# EAGLE board Send3 (EAGLE 6.5.0)
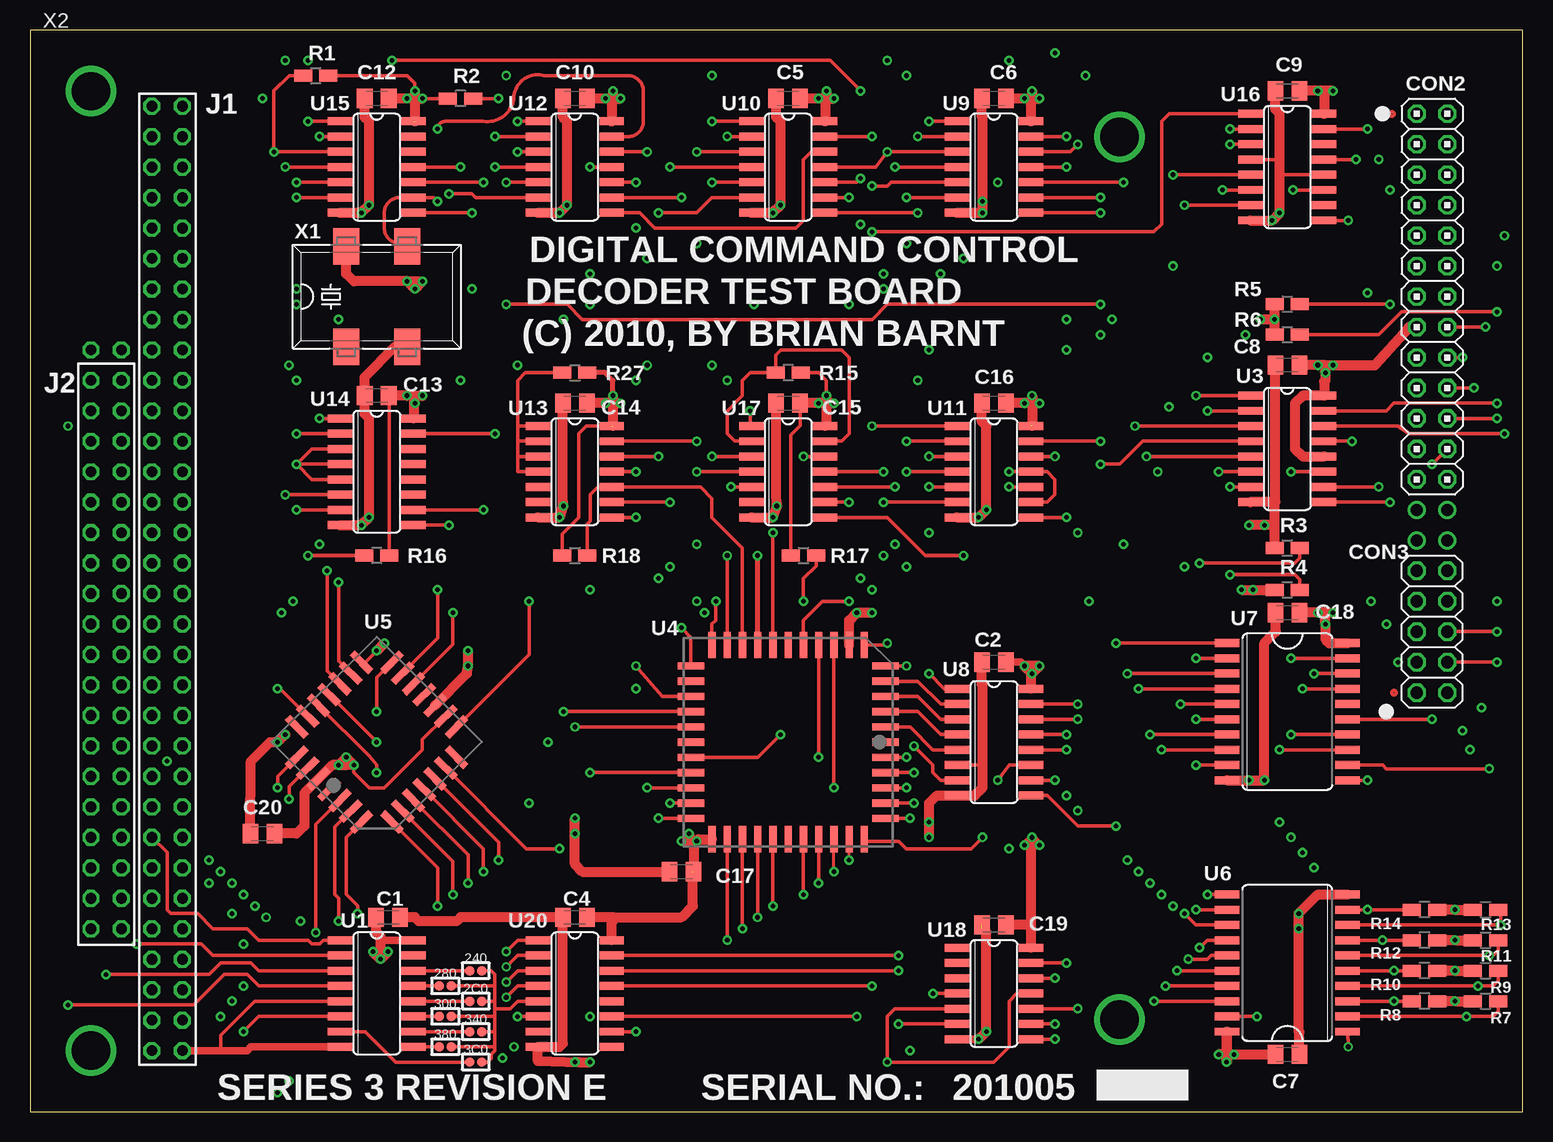
[diagram p7: board, top side]
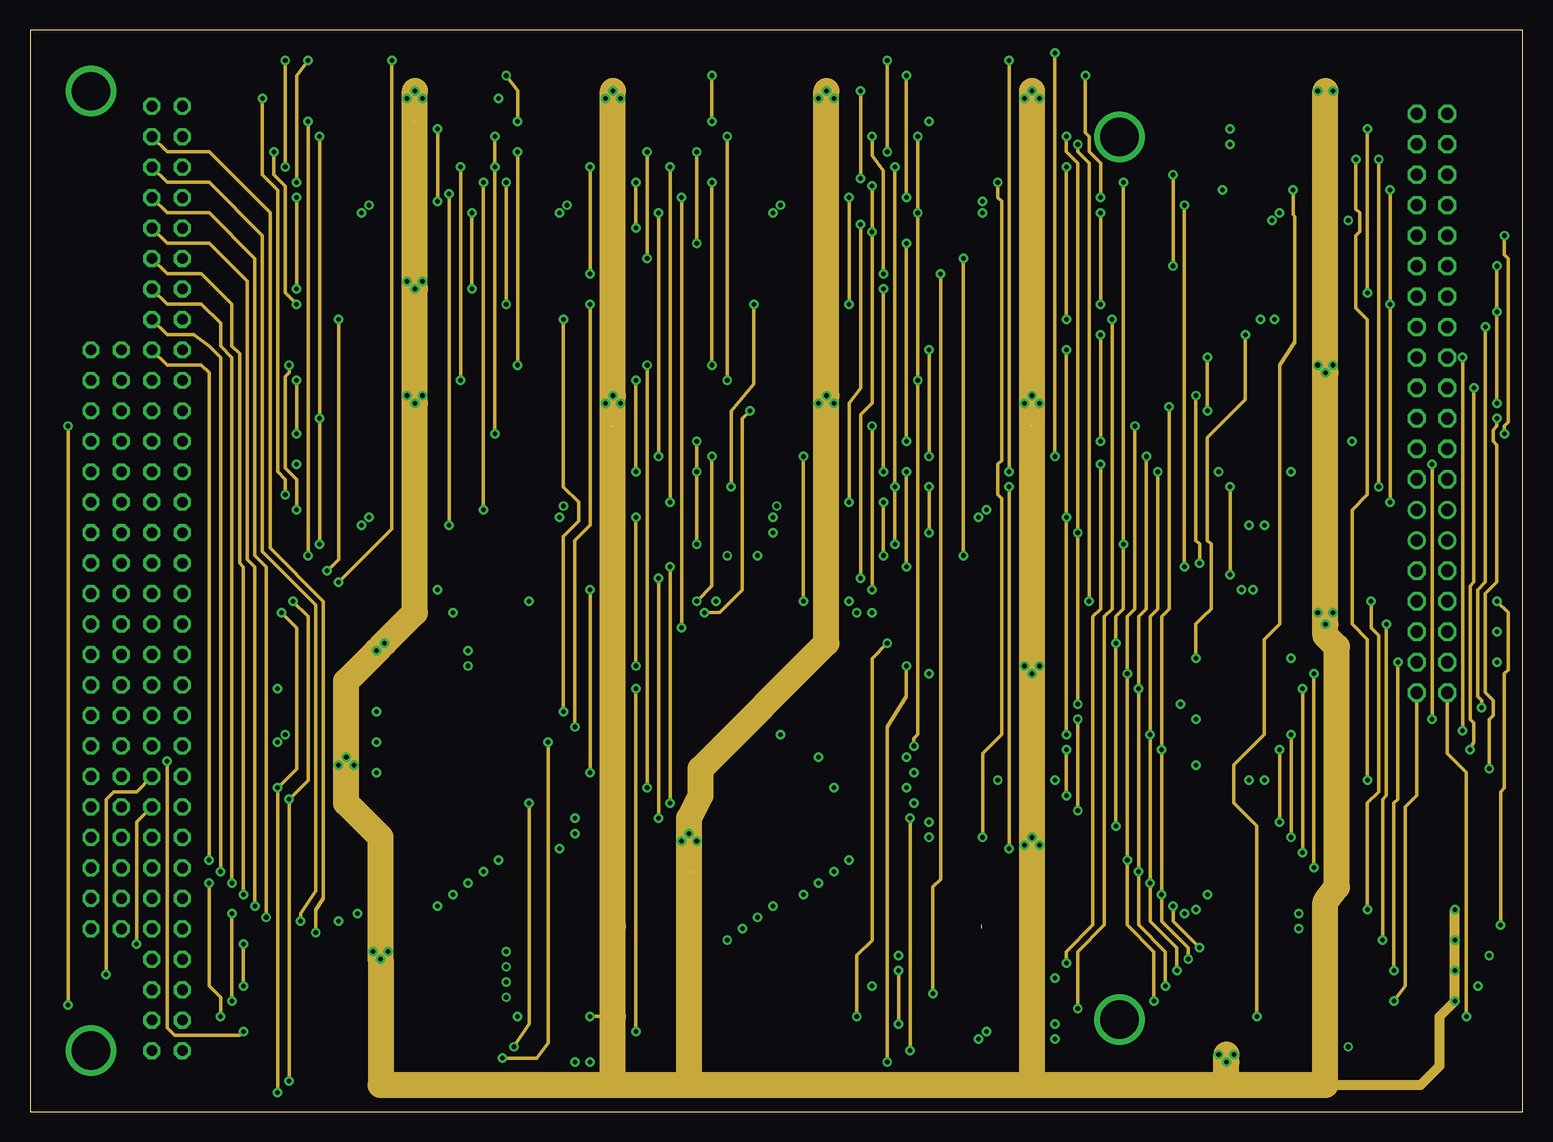
[diagram p8: board, inner layer Route2]
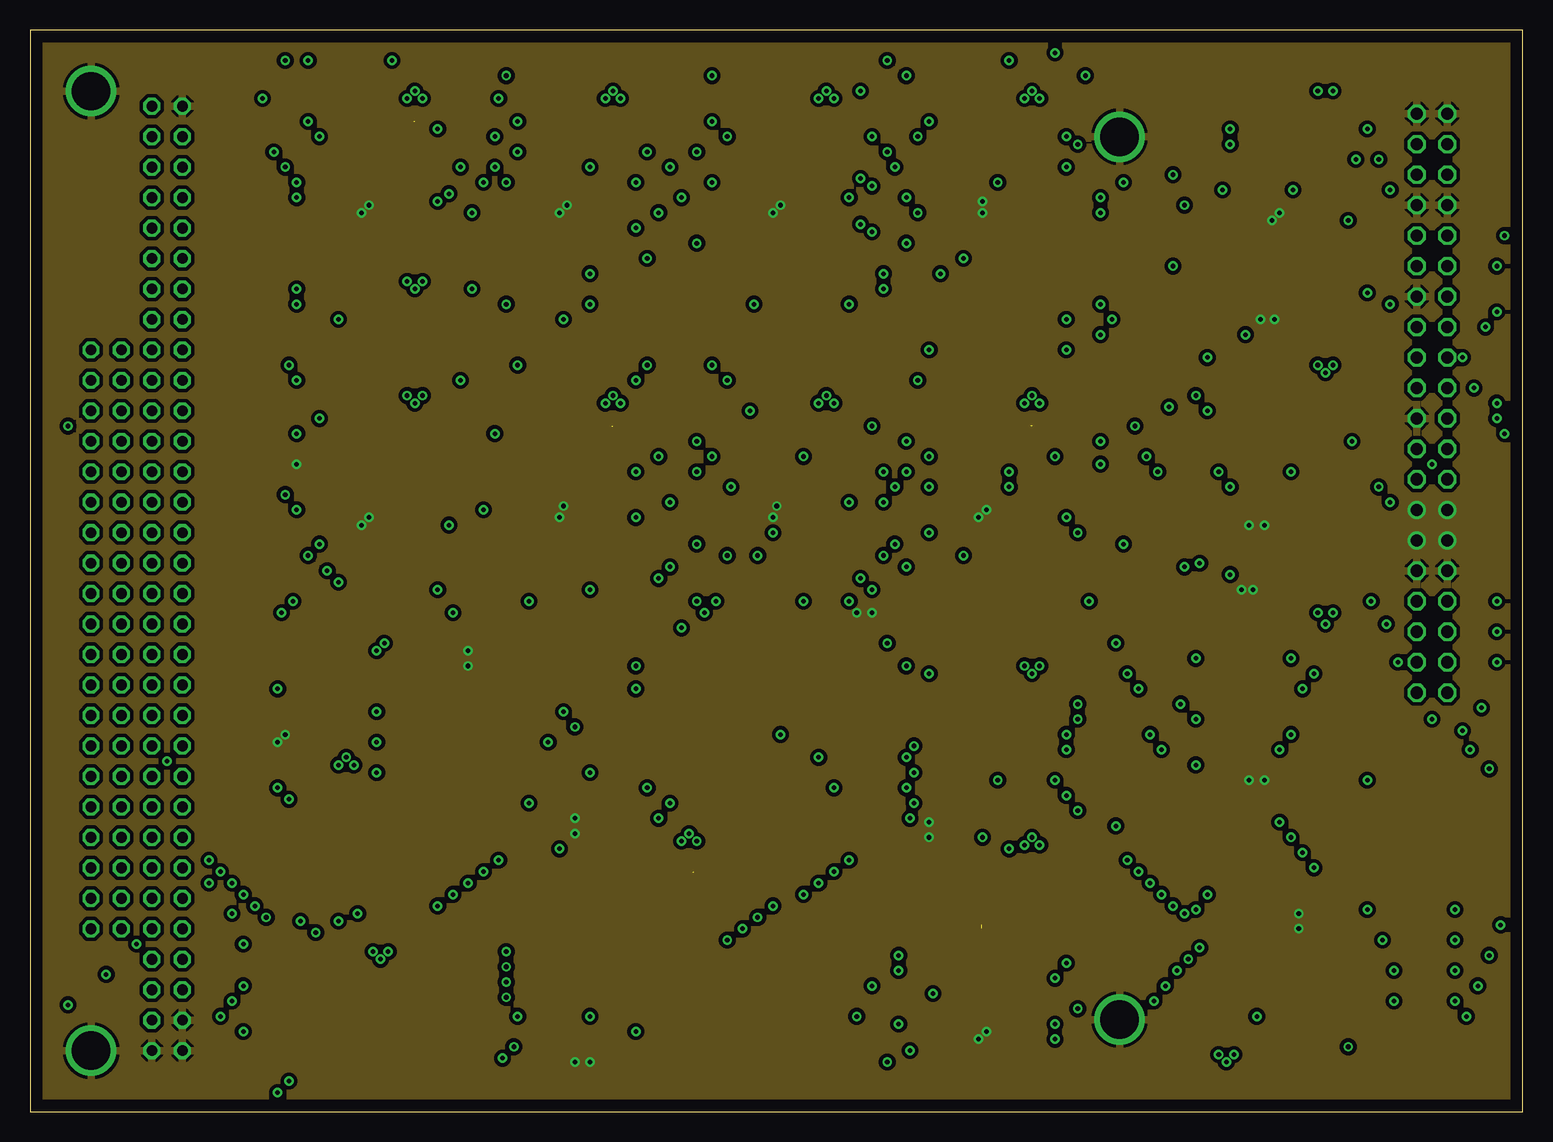
[diagram p9: board, inner layer Route15]
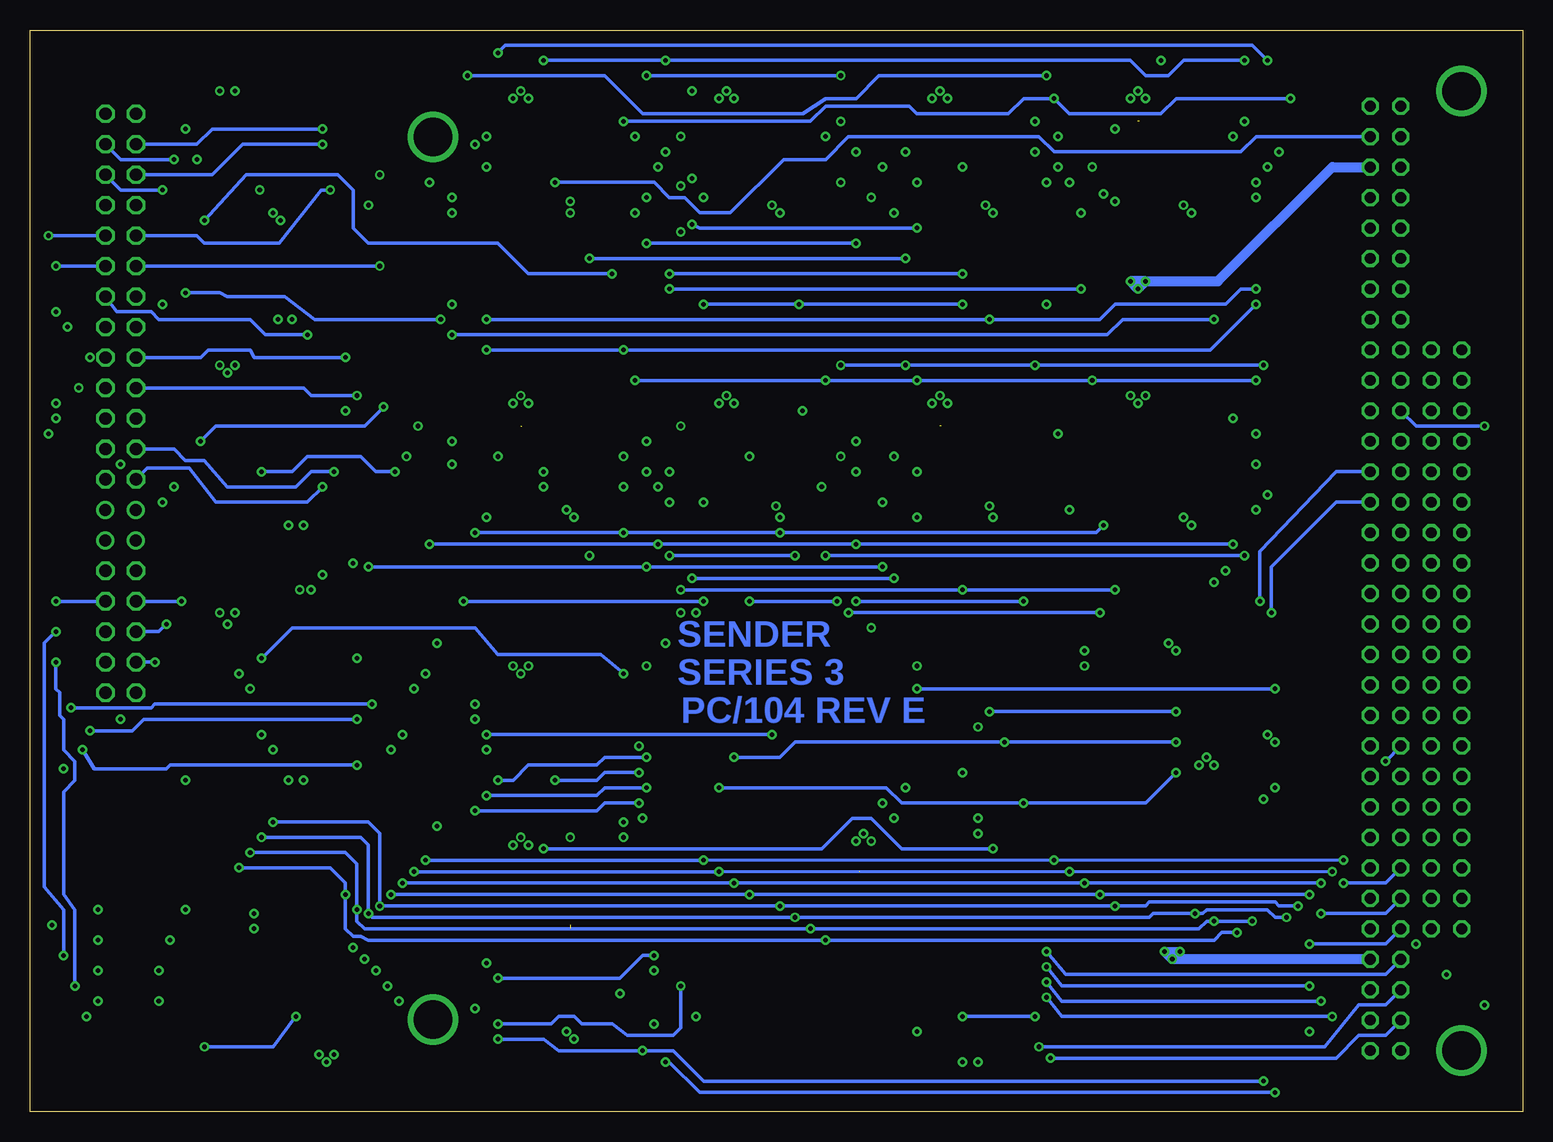
[diagram p10: board, bottom side, seen from below]

Size 124.4 x 90.2 mm. Coordinates in mm from the lower left corner, seen from the top.
Copper layers (1+2*15+16): Top 0.035mm / dielectric 0.2mm / Route2 0.035mm / dielectric 0.15mm / Route15 0.035mm / dielectric 0.2mm / Bottom 0.035mm
Design rules "Advanced33 *": minimum track width 8mil, minimum drill 15mil, track to track 8mil, track to pad 8mil, pad to pad 8mil, via to via 8mil, smd to smd 8mil, copper to edge 40mil, drill to drill 8mil, minimum pad ring 10mil, minimum via ring 8mil, stop-mask expansion 4mil, vias tented up to drill 25mil, thermal gap 10mil

## Footprints (pad centres in the part's own frame; a part is rotated, then mirrored left to right if it is on the bottom)
C0805K = smd 1.3 x 1.6: 1 -1,0; 2 1,0
2X13 = drill 1.016 octagon: 1 -15.24,-1.27; 2 -15.24,1.27; 3 -12.7,-1.27; 4 -12.7,1.27; 5 -10.16,-1.27; 6 -10.16,1.27; 7 -7.62,-1.27; 8 -7.62,1.27; 9 -5.08,-1.27; 10 -5.08,1.27; 11 -2.54,-1.27; 12 -2.54,1.27; 13 0,-1.27; 14 0,1.27; 15 2.54,-1.27; 16 2.54,1.27; 17 5.08,-1.27; 18 5.08,1.27; 19 7.62,-1.27; 20 7.62,1.27; 21 10.16,-1.27; 22 10.16,1.27; 23 12.7,-1.27; 24 12.7,1.27; 25 15.24,-1.27; 26 15.24,1.27
2X05 = drill 1.016 octagon: 1 -5.08,-1.27; 2 -5.08,1.27; 3 -2.54,-1.27; 4 -2.54,1.27; 5 0,-1.27; 6 0,1.27; 7 2.54,-1.27; 8 2.54,1.27; 9 5.08,-1.27; 10 5.08,1.27
SOLDER_BRIDGE = smd 0.787 x 0.787: P$1 -0.508,0; P$2 0.508,0
R0805W = smd 1.5 x 1: 1 -1.052,0; 2 1.052,0
SO16 = smd 0.66 x 2.032: 1 -4.445,-3.073; 2 -3.175,-3.073; 3 -1.905,-3.073; 4 -0.635,-3.073; 5 0.635,-3.073; 6 1.905,-3.073; 7 3.175,-3.073; 8 4.445,-3.073; 9 4.445,3.073; 10 3.175,3.073; 11 1.905,3.073; 12 0.635,3.073; 13 -0.635,3.073; 14 -1.905,3.073; 15 -3.175,3.073; 16 -4.445,3.073
PLCC44 = smd 0.6 x 2.2: 1 0,8.1; 2 -1.27,8.1; 3 -2.54,8.1; 4 -3.81,8.1; 5 -5.08,8.1; 6 -6.35,8.1; 18 -6.35,-8.1; 19 -5.08,-8.1; 20 -3.81,-8.1; 21 -2.54,-8.1; 22 -1.27,-8.1; 23 0,-8.1; 24 1.27,-8.1; 25 2.54,-8.1; 26 3.81,-8.1; 27 5.08,-8.1; 28 6.35,-8.1; 40 6.35,8.1; 41 5.08,8.1; 42 3.81,8.1; 43 2.54,8.1; 44 1.27,8.1 | smd 2.2 x 0.6: 7 -8.1,6.35; 8 -8.1,5.08; 9 -8.1,3.81; 10 -8.1,2.54; 11 -8.1,1.27; 12 -8.1,0; 13 -8.1,-1.27; 14 -8.1,-2.54; 15 -8.1,-3.81; 16 -8.1,-5.08; 17 -8.1,-6.35; 29 8.1,-6.35; 30 8.1,-5.08; 31 8.1,-3.81; 32 8.1,-2.54; 33 8.1,-1.27; 34 8.1,0; 35 8.1,1.27; 36 8.1,2.54; 37 8.1,3.81; 38 8.1,5.08; 39 8.1,6.35
PLCC28S = smd 0.6 x 2.2: 1 0,5.6; 2 -1.27,5.6; 3 -2.54,5.6; 4 -3.81,5.6; 12 -3.81,-5.6; 13 -2.54,-5.6; 14 -1.27,-5.6; 15 0,-5.6; 16 1.27,-5.6; 17 2.54,-5.6; 18 3.81,-5.6; 26 3.81,5.6; 27 2.54,5.6; 28 1.27,5.6 | smd 2.2 x 0.6: 5 -5.6,3.81; 6 -5.6,2.54; 7 -5.6,1.27; 8 -5.6,0; 9 -5.6,-1.27; 10 -5.6,-2.54; 11 -5.6,-3.81; 19 5.6,-3.81; 20 5.6,-2.54; 21 5.6,-1.27; 22 5.6,0; 23 5.6,1.27; 24 5.6,2.54; 25 5.6,3.81
SO20W = smd 0.66 x 2.032: 1 -5.715,-5.029; 2 -4.445,-5.029; 3 -3.175,-5.029; 4 -1.905,-5.029; 5 -0.635,-5.029; 6 0.635,-5.029; 7 1.905,-5.029; 8 3.175,-5.029; 9 4.445,-5.029; 10 5.715,-5.029; 11 5.715,5.029; 12 4.445,5.029; 13 3.175,5.029; 14 1.905,5.029; 15 0.635,5.029; 16 -0.635,5.029; 17 -1.905,5.029; 18 -3.175,5.029; 19 -4.445,5.029; 20 -5.715,5.029
SO14 = smd 0.66 x 2.032: 1 -3.81,-3.073; 2 -2.54,-3.073; 3 -1.27,-3.073; 4 0,-3.073; 5 1.27,-3.073; 6 2.54,-3.073; 7 3.81,-3.073; 8 3.81,3.073; 9 2.54,3.073; 10 1.27,3.073; 11 0,3.073; 12 -1.27,3.073; 13 -2.54,3.073; 14 -3.81,3.073
1100S = smd 2.184 x 3.048: 1 -2.54,-4.191; 2 2.54,-4.191; 3 2.54,4.191; 4 -2.54,4.191
PC104-STANDARD = drill 0.9 pad 1.397 octagon: A1 10.16,83.82; A2 10.16,81.28; A3 10.16,78.74; A4 10.16,76.2; A5 10.16,73.66; A6 10.16,71.12; A7 10.16,68.58; A8 10.16,66.04; A9 10.16,63.5; A10 10.16,60.96; A11 10.16,58.42; A12 10.16,55.88; A13 10.16,53.34; A14 10.16,50.8; A15 10.16,48.26; A16 10.16,45.72; A17 10.16,43.18; A18 10.16,40.64; A19 10.16,38.1; A20 10.16,35.56; A21 10.16,33.02; A22 10.16,30.48; A23 10.16,27.94; A24 10.16,25.4; A25 10.16,22.86; A26 10.16,20.32; A27 10.16,17.78; A28 10.16,15.24; A29 10.16,12.7; A30 10.16,10.16; A31 10.16,7.62; A32 10.16,5.08; B1 12.7,83.82; B2 12.7,81.28; B3 12.7,78.74; B4 12.7,76.2; B5 12.7,73.66; B6 12.7,71.12; B7 12.7,68.58; B8 12.7,66.04; B9 12.7,63.5; B10 12.7,60.96; B11 12.7,58.42; B12 12.7,55.88; B13 12.7,53.34; B14 12.7,50.8; B15 12.7,48.26; B16 12.7,45.72; B17 12.7,43.18; B18 12.7,40.64; B19 12.7,38.1; B20 12.7,35.56; B21 12.7,33.02; B22 12.7,30.48; B23 12.7,27.94; B24 12.7,25.4; B25 12.7,22.86; B26 12.7,20.32; B27 12.7,17.78; B28 12.7,15.24; B29 12.7,12.7; B30 12.7,10.16; B31 12.7,7.62; B32 12.7,5.08; C0 7.62,63.5; C1 7.62,60.96; C2 7.62,58.42; C3 7.62,55.88; C4 7.62,53.34; C5 7.62,50.8; C6 7.62,48.26; C7 7.62,45.72; C8 7.62,43.18; C9 7.62,40.64; C10 7.62,38.1; C11 7.62,35.56; C12 7.62,33.02; C13 7.62,30.48; C14 7.62,27.94; C15 7.62,25.4; C16 7.62,22.86; C17 7.62,20.32; C18 7.62,17.78; C19 7.62,15.24; D0 5.08,63.5; D1 5.08,60.96; D2 5.08,58.42; D3 5.08,55.88; D4 5.08,53.34; D5 5.08,50.8; D6 5.08,48.26; D7 5.08,45.72; D8 5.08,43.18; D9 5.08,40.64; D10 5.08,38.1; D11 5.08,35.56; D12 5.08,33.02; D13 5.08,30.48; D14 5.08,27.94; D15 5.08,25.4; D16 5.08,22.86; D17 5.08,20.32; D18 5.08,17.78; D19 5.08,15.24 | drill 3.2 pad 4: GND@1 90.8,81.27; GND@2 90.8,7.67; GND@3 5.1,85.07; GND@4 5.1,5.07

## Placement (x,y rotation side)
C1  [C0805K]  29.84,16.22 0 top
C2  [C0805K]  80.33,37.5 180 top
C4  [C0805K]  45.4,16.22 180 top
C5  [C0805K]  63.18,84.48 180 top
C6  [C0805K]  80.33,84.48 180 top
C7  [C0805K]  104.78,4.79 0 top
C8  [C0805K]  104.78,62.26 180 top
C9  [C0805K]  104.78,85.12 180 top
C10  [C0805K]  45.4,84.48 180 top
C12  [C0805K]  28.89,84.48 180 top
C13  [C0805K]  28.89,59.72 180 top
C14  [C0805K]  45.4,59.09 180 top
C15  [C0805K]  63.18,59.09 180 top
C16  [C0805K]  80.33,59.09 180 top
C17  [C0805K]  54.29,20.03 180 top
C18  [C0805K]  104.78,41.62 180 top
C19  [C0805K]  80.33,15.59 180 top
C20  [C0805K]  19.37,23.21 180 top
CON2  [2X13]  116.84,67.97 270 top
CON3  [2X05]  116.84,40.04 90 top
JMPR2  [SOLDER_BRIDGE]  37.15,11.78 0 top
JMPR3  [SOLDER_BRIDGE]  34.61,10.51 0 top
JMPR4  [SOLDER_BRIDGE]  37.15,9.24 0 top
JMPR5  [SOLDER_BRIDGE]  34.61,7.97 0 top
JMPR6  [SOLDER_BRIDGE]  37.15,6.7 0 top
JMPR7  [SOLDER_BRIDGE]  34.61,5.43 0 top
JMPR8  [SOLDER_BRIDGE]  37.15,4.16 0 top
R1  10K  [R0805W]  23.81,86.39 0 top
R2  10K  [R0805W]  35.88,84.48 180 top
R3  10K  [R0805W]  104.78,47.02 0 top
R4  10K  [R0805W]  104.78,43.53 0 top
R5  10K  [R0805W]  104.78,67.34 0 top
R6  10K  [R0805W]  104.78,64.8 0 top
R7  10K  [R0805W]  121.28,9.24 0 top
R8  10K  [R0805W]  116.2,9.24 180 top
R9  10K  [R0805W]  121.28,11.78 0 top
R10  10K  [R0805W]  116.2,11.78 180 top
R11  10K  [R0805W]  121.28,14.32 0 top
R12  10K  [R0805W]  116.2,14.32 180 top
R13  10K  [R0805W]  121.28,16.86 0 top
R14  10K  [R0805W]  116.2,16.86 180 top
R15  10K  [R0805W]  63.18,61.62 180 top
R16  10K  [R0805W]  28.89,46.38 180 top
R17  10K  [R0805W]  64.45,46.38 0 top
R18  10K  [R0805W]  45.4,46.38 0 top
R27  10K  [R0805W]  45.4,61.62 0 top
U1  74AHC138D  [SO16]  28.89,9.87 270 top
U3  AM26C32CD  [SO16]  104.78,55.27 270 top
U4  [PLCC44]  63.18,30.83 270 top
U5  8254  [PLCC28S]  28.89,30.83 135 top
U6  74ACT540  [SO20W]  104.78,12.41 90 top
U7  74LS273DW  [SO20W]  104.78,33.37 270 top
U8  74HCT166D  [SO16]  80.33,30.83 270 top
U9  74ACT74D  [SO14]  80.33,78.77 270 top
U10  74ACT08D  [SO14]  63.18,78.77 270 top
U11  74ACT02D  [SO14]  80.33,53.37 270 top
U12  74ACT00D  [SO14]  45.4,78.77 270 top
U13  74ACT74D  [SO14]  45.4,53.37 270 top
U14  74ACT161D  [SO16]  28.89,53.37 270 top
U15  74AC04D  [SO14]  28.89,78.77 270 top
U16  AM26C31CD  [SO16]  104.78,78.77 270 top
U17  74ACT74D  [SO14]  63.18,53.37 270 top
U18  74ACT02D  [SO14]  80.33,9.87 270 top
U20  74AHC138D  [SO16]  45.4,9.87 270 top
U$5  [BORDER_AL]  -70.17,-74.58 0 top  (outside the outline)
X1  [1100S]  28.89,67.97 0 top
X2  PC104_CARD1  [PC104-STANDARD]  0,0.03 0 top

## Tracks (layer width: path | path; a pad name or v marks a point on that pad's centre or on a via)
82CLK0T  (via drill 0.38)
  Top 0.305: v81.6,52.1 U11.10 | v44.13,21.94 41.37,21.94 U5.10
  Route2 0.305: v81.6,21.94 v81.6,52.1
  Bottom 0.305: v44.13,21.94 51.75,21.94 54.29,24.48 55.88,24.48 58.42,21.94 v81.6,21.94
82CLK1T  (via drill 0.38)
  Top 0.305: v89.22,55.91 U11.13 | v24.77,45.12 24.77,36.75 U5.21
  Route2 0.305: v89.22,64.8 v89.22,55.91 | v25.72,66.07 25.72,46.07 v24.77,45.12
  Bottom 0.305: v25.72,66.07 33.34,66.07 34.61,64.8 v89.22,64.8
82G0H  (via drill 0.38)
  Top 0.305: v46.67,28.29 U4.25 | v70.17,57.18 U11.1 | v33.97,43.53 33.97,39.5 U5.17
  Route2 0.305: v46.67,43.53 v46.67,28.29 | v70.17,43.53 v70.17,57.18
  Bottom 0.305: v33.97,43.53 v46.67,43.53 v70.17,43.53
82OUT0H  (via drill 0.38)
  Top 0.305: U17.1 60.01,57.28 v60.01,58.45 | v35.24,41.62 35.24,38.97 U5.16
  Route2 0.305: v60.01,58.45 59.37,57.81 59.37,43.53 57.47,41.62 v56.2,41.62
  Bottom 0.305: v35.24,41.62 v56.2,41.62
82OUT0T  (via drill 0.38)
  Top 0.305: v56.83,54.64 U17.3 | v41.59,42.58 41.59,38.14 U5.12
  Route2 0.305: v56.83,54.64 56.83,43.84 v55.56,42.58
  Bottom 0.305: v41.59,42.58 v55.56,42.58
!ACK_FEEDBACK  (via drill 0.38)
  Top 0.305: v100.01,52.1 U3.7 | R4.2 105.83,44.38 105.41,44.8 v100.01,44.8
  Route2 0.305: v100.01,44.8 v100.01,52.1
  Bottom 0.305: CON2.25 114.62,53.69 111.12,53.69 108.9,50.83 101.28,50.83 v100.01,52.1
!AE  (via drill 0.38)
  Top 0.305: v3.17,8.92 13.65,8.92 16.19,11.46 18.1,11.46 19.05,10.51 U1.4
  Route2 0.305: v3.17,8.92 v3.17,57.18
  Bottom 0.305: X2.A11 8.89,57.18 v3.17,57.18
!AUXIN  (via drill 0.38)
  Top 0.305: v105.25,76.86 U16.11 | U6.19 v102.23,7.97 | U6.1 109.8,6.11 109.86,6.06 v109.86,5.43
  Route2 0.305: v105.25,76.86 105.25,74.8 105.41,74.64 105.41,64.17 104.14,62.26 104.14,40.67 102.87,39.4 102.87,31.46 100.33,28.92 100.33,25.75 102.23,23.84 v102.23,7.97
  Bottom 0.305: v109.86,5.43 104.14,5.43 v102.23,7.97
!AUXOUT  (via drill 0.38)
  Top 0.305: v110.49,79.41 U16.13 | U7.11 v111.44,27.65
  Route2 0.305: v111.44,27.65 111.44,39.4 110.17,40.67 110.17,50.2 111.44,51.47 111.44,66.07 110.49,67.02 110.49,73.06 110.81,73.37 110.81,74.96 110.49,75.28 v110.49,79.41
!CLK1  (via drill 0.38)
  Top 0.305: v44.45,33.37 U4.21 | v22.23,76.23 U15.6 | v86.36,78.77 U9.11 | v28.89,33.37 28.89,36.22 U5.18
  Route2 0.305: v44.45,33.37 44.45,47.97 45.72,49.24 45.72,50.83 44.45,52.1 v44.45,66.07 | v22.23,68.61 v22.23,76.23 | v86.36,66.07 v86.36,78.77
  Bottom 0.305: v22.23,68.61 23.5,68.61 24.77,67.34 33.97,67.34 35.24,66.07 v44.45,66.07 v86.36,66.07 | v28.89,33.37 v44.45,33.37
!CPUCLK  (via drill 0.38)
  Top 0.305: U4.18 55.08,39.56 v54.29,40.35 | v54.29,76.23 U12.9
  Route2 0.305: v54.29,40.35 v54.29,76.23
!DATALD  (via drill 0.38)
  Top 0.305: v61.91,48.29 U4.13 | v74.93,52.1 U11.5 | v86.36,81.31 U9.13 | v87.31,34 U8.15 | v34.92,76.55 36.83,76.55 37.15,76.23 U12.6 | U14.9 v34.92,48.93
  Route2 0.305: v74.93,48.29 v74.93,52.1 | v86.36,81.31 86.36,80.04 87.31,79.09 v87.31,48.29 v87.31,34 | v34.92,48.93 v34.92,76.55
  Bottom 0.305: v74.93,48.29 v61.91,48.29 35.56,48.29 v34.92,48.93 | v74.93,48.29 77.79,48.29 | v74.93,48.29 v87.31,48.29
!DATARDY  (via drill 0.38)
  Top 0.305: v89.22,76.23 U9.9 | U12.1 v40.64,82.58
  Route2 0.305: v87.95,86.39 87.95,81.63 88.27,81.31 88.27,80.04 89.22,79.09 v89.22,76.23 | v40.64,82.58 40.64,85.12 v39.69,86.39
  Bottom 0.305: v87.95,86.39 76.52,86.39 73.34,83.22 60.01,83.22 58.1,84.48 55.56,84.48 53.66,86.39 v39.69,86.39
!DCC_OUT  (via drill 0.38)
  Top 0.305: v100.01,80.67 U16.3
  Bottom 0.305: v100.01,80.67 106.68,80.67 109.22,78.14 CON2.5
!DCCOUT  (via drill 0.38)
  Top 0.305: U14.10 v37.78,50.2 | v37.78,77.5 U15.10
  Route2 0.305: v37.78,50.2 v37.78,77.5
!DCCOUTD  (via drill 0.38)
  Top 0.305: v73.03,76.23 U9.6 | v56.83,82.58 U10.1
  Route2 0.305: v73.03,86.39 v73.03,76.23 | v56.83,82.58 v56.83,86.39
  Bottom 0.305: v56.83,86.39 v73.03,86.39
!HL_FEEDBACK  (via drill 0.38)
  Top 0.305: U3.9 v113.35,50.83 | v113.35,67.34 R5.2
  Route2 0.305: v113.35,50.83 v113.35,67.34 v113.35,76.86
  Bottom 0.305: v113.35,76.86 116.84,76.86 CON2.6
!LCPUEN  (via drill 0.38)
  Top 0.305: U17.8 71.44,49.56 74.61,46.38 v77.79,46.38 | v51.44,80.04 U12.12
  Route2 0.305: v77.79,46.38 v77.79,71.15 | v51.44,71.15 v51.44,80.04
  Bottom 0.305: v77.79,71.15 v51.44,71.15
!MOTOR_FEEDBACK  (via drill 0.38)
  Top 0.305: v97.16,59.72 U3.1 | R3.2 105.83,46.17 105.41,45.75 v97.47,45.75
  Route2 0.305: v97.47,45.75 97.47,47.34 97.16,47.66 v97.16,59.72
  Bottom 0.305: CON2.19 101.6,60.36 100.97,59.72 v97.16,59.72
!OBFA  (via drill 0.38)
  Top 0.305: U4.11 64.45,40.99 66.04,42.58 v68.26,42.58 | v87.31,80.67 86.68,80.04 U9.12
  Route2 0.305: v88.27,42.58 88.27,79.09 87.31,80.04 v87.31,80.67
  Bottom 0.305: v68.26,42.58 v88.27,42.58
!OSC1  (via drill 0.38)
  Top 0.305: v33.97,75.91 33.66,76.23 U15.9 30.8,76.23 arc90 29.53,74.96 29.53,73.69 arc90 30.8,72.42 31.18,72.42 arc-90 X1.3 | U12.13 49.85,81.31 arc90 51.12,82.58 51.12,85.12 arc90 49.85,86.39 42.86,86.39 arc106 40.32,84.48 arc-90 37.78,82.58 34.61,82.58 arc90 v33.97,81.95
  Route2 0.305: v33.97,75.91 v33.97,81.95
!PCRST  (via drill 0.38)
  Top 0.305: v90.49,23.84 87.31,23.84 84.77,26.38 U8.9 | v24.13,81.31 U15.2 | v24.13,57.81 U14.1 | v55.56,55.91 U13.13 | v55.56,53.37 U17.4 | v72.07,52.1 U17.10 | v72.07,78.77 U9.4 | v91.12,77.5 U9.10 | v90.49,39.08 U7.1
  Route2 0.305: v90.49,23.84 v90.49,39.08 90.49,41.3 91.12,41.94 v91.12,47.34 v91.12,77.5 | v24.13,47.34 v24.13,57.81 v24.13,81.31 | v55.56,47.34 v55.56,53.37 v55.56,55.91 | v72.07,47.34 v72.07,52.1 v72.07,78.77
  Bottom 0.305: v24.13,47.34 v55.56,47.34 v72.07,47.34 v91.12,47.34
!RD  (via drill 0.38)
  Top 0.305: v73.03,37.18 U4.6 | v20.64,27.02 20.64,27.96 U5.26 | U18.11 82.23,9.87 81.6,9.24 81.6,5.43 80.33,4.16 v71.44,4.16 71.44,7.97 72.07,8.6 U18.5
  Route2 0.305: v73.03,37.18 73.03,34.64 71.44,32.1 v71.44,4.16 | v20.64,1.62 v20.64,27.02 22.23,28.61 22.23,40.35 v20.95,41.62
  Bottom 0.305: v20.64,1.62 67.31,1.62 | 67.31,1.62 66.99,1.62 | 67.31,1.62 68.58,1.62 71.12,4.16 v71.44,4.16 | X2.B14 15.56,50.83 20.95,45.43 v20.95,41.62
!RL_FEEDBACK  (via drill 0.38)
  Top 0.305: U3.15 113.03,58.45 113.67,59.09 v122.24,59.09 | R6.2 112.39,64.8 114.3,66.7 v122.24,66.7
  Route2 0.305: v122.24,59.09 v122.24,66.7 v122.24,70.52
  Bottom 0.305: v122.24,70.52 CON2.12
!SCOPE_ENBL  (via drill 0.38)
  Top 0.305: v71.12,50.83 U11.6
  Top 0.406: U4.14 v60.64,46.38
  Route2 0.305: v71.12,46.38 v71.12,50.83
  Bottom 0.305: v60.64,46.38 v71.12,46.38
!SCOPE_SYNC  (via drill 0.38)
  Top 0.305: v95.25,78.14 U16.5
  Route2 0.305: v95.25,70.52 v95.25,78.14
  Bottom 0.305: v95.25,70.52 CON2.11
!SEL0  (via drill 0.38)
  Top 0.305: U20.15 v72.39,13.05 | v85.41,11.14 U18.12
  Bottom 0.305: v72.39,13.05 73.34,13.05 75.25,11.14 v85.41,11.14
!SEL1  (via drill 0.38 pad 0.61)
  Top 0.305: v72.39,7.33 U18.6 | U20.14 v72.39,11.78
  Route2 0.305: v72.39,11.78 v72.39,7.33
!SEL2  (via drill 0.38)
  Top 0.305: U20.13 v70.17,10.51 | v85.41,7.33 U18.9
  Bottom 0.305: v70.17,10.51 70.17,7.02 70.8,6.38 74.61,6.38 75.88,7.33 78.42,7.33 79.06,7.97 80.33,7.97 80.96,7.33 v85.41,7.33
!SEL8254  (via drill 0.38)
  Top 0.305: v50.48,6.7 U20.10 | v20.64,35.27 20.86,35.27 U5.24
  Route2 0.305: v50.48,35.27 v50.48,6.7
  Bottom 0.305: v20.64,35.27 v50.48,35.27
!SEL8255  (via drill 0.38)
  Top 0.305: U4.7 71.28,38.93 v71.44,39.08 | U20.11 v68.9,7.97
  Route2 0.305: v68.9,7.97 68.9,13.05 70.17,14.32 70.17,37.81 v71.44,39.08
!SHOLD  (via drill 0.38)
  Top 0.305: v51.44,27.02 U4.26 | v22.23,50.2 U14.7 | v40.64,80.04 U12.3 | v56.83,77.5 U10.5
  Route2 0.305: v51.44,62.26 v51.44,27.02 | v22.23,50.2 22.23,52.73 21.27,53.69 21.27,61.31 21.59,61.62 v21.59,62.26 | v40.64,62.26 v40.64,80.04 | v56.83,62.26 v56.83,77.5
  Bottom 0.305: v21.59,62.26 v40.64,62.26 v51.44,62.26 v56.83,62.26
!UNDERCLR
  Top 0.305: U4.15 59.37,47.02 56.83,49.56 56.83,51.15 55.88,52.1 U13.10 47.31,52.1 46.67,51.47 46.67,49.24 46.45,49.02 R18.2
!WR  (via drill 0.38)
  Top 0.305: v21.59,26.07 21.59,27.12 U5.27 | v85.41,6.06 U18.8 | v73.34,24.48 U4.40
  Route2 0.305: v73.34,5.11 v73.34,24.48 | v21.59,2.57 v21.59,26.07 23.18,27.65 23.18,41.3 v21.91,42.58
  Bottom 0.305: v85.41,6.06 81.6,6.06 80.33,5.11 v73.34,5.11 70.8,5.11 68.26,2.57 v21.59,2.57 | X2.B13 15.56,53.37 21.91,46.7 v21.91,42.58
A0  (via drill 0.38)  (1 unrouted)
  Top 0.305: U5.22 v28.89,30.83 | v65.72,29.56 U4.10
  Route2 0.305: v39.37,4.48 42.23,4.48 43.18,5.75 v43.18,30.83
  Bottom 0.305: v28.89,30.83 v43.18,30.83 60.64,30.83 61.91,29.56 v65.72,29.56 | v39.37,4.48 15.56,4.48 13.65,6.38 11.43,6.38 X2.A31
A1  (via drill 0.38)
  Top 0.305: v28.89,28.29 28.89,28.92 28.26,29.67 U5.23 | v66.99,27.02 U4.9
  Route2 0.305: v40.32,5.43 41.59,7.33 v41.59,25.75
  Bottom 0.305: 31.43,25.75 v41.59,25.75 51.75,25.75 53.02,27.02 v66.99,27.02 | 31.43,25.75 30.8,26.38 | 31.43,25.75 v28.89,28.29 | X2.A30 11.43,8.92 13.65,8.92 16.51,5.43 v40.32,5.43
A2  (via drill 0.38)
  Top 0.305: U20.1 40.64,14.32 v39.69,13.37
  Bottom 0.305: v39.69,13.37 38.1,11.46 11.43,11.46 X2.A29
A3  (via drill 0.38)
  Top 0.305: v39.69,12.09 40.64,13.05 U20.2
  Route2 0.305: v17.78,14 v17.78,10.51
  Bottom 0.305: v39.69,12.09 38.42,10.51 v17.78,10.51 | v17.78,14 11.43,14 X2.A28
A4  (via drill 0.38)
  Top 0.305: U20.3 40.64,11.78 v39.69,10.82
  Route2 0.305: v16.83,9.24 v16.83,16.54
  Bottom 0.305: v39.69,10.82 38.42,9.24 v16.83,9.24 | v16.83,16.54 11.43,16.54 X2.A27
A5  (via drill 0.38)
  Top 0.305: v39.69,9.55 40.64,10.51 U20.4
  Route2 0.305: v15.88,7.97 15.88,9.55 14.92,10.51 v14.92,19.08
  Bottom 0.305: v39.69,9.55 38.42,7.97 v15.88,7.97 | v14.92,19.08 11.43,19.08 X2.A26
A6
  Top 0.305: X2.A25 11.43,21.62 11.43,16.86 11.75,16.54 13.97,16.54 15.24,15.27 18.1,15.27 19.05,14.32 23.18,14.32 23.5,14 24.13,14 24.45,14.32 U1.1
A7  (via drill 0.38)
  Top 0.305: U1.2 15.24,13.05 14.29,14 v8.89,14
  Route2 0.305: v8.89,14 8.89,24.16 X2.A24
A8  (via drill 0.38)
  Top 0.305: U1.3 19.05,11.78 18.41,12.41 15.88,12.41 14.92,11.46 v6.35,11.46
  Route2 0.305: v6.35,11.46 6.35,26.07 6.99,26.7 8.89,26.7 X2.A23
A9  (via drill 0.38)
  Top 0.305: v17.78,6.7 19.05,7.97 U1.6
  Route2 0.305: v11.43,29.24 11.43,7.02 12.06,6.38 17.46,6.38 v17.78,6.7
  Bottom 0.305: v11.43,29.24 X2.A22
ACK_FEEDBACK  (via drill 0.38)
  Top 0.305: v99.06,53.37 U3.6
  Bottom 0.305: CON2.23 112.39,55.27 111.44,54.32 109.86,54.32 107.95,52.1 102.23,52.1 100.97,53.37 v99.06,53.37
AUXIN  (via drill 0.38)
  Top 0.305: v109.86,74.33 U16.9 | v75.25,9.87 U18.4
  Route2 0.305: v75.88,69.88 75.88,19.4 75.25,18.76 v75.25,9.87
  Bottom 0.305: v109.86,74.33 106.36,78.14 98.74,78.14 97.47,76.86 97.47,73.69 96.2,72.42 85.41,72.42 82.87,69.88 v75.88,69.88
AUXOUT  (via drill 0.38)
  Top 0.305: U18.10 v87.31,8.6 | v111.44,81.95 U16.15
  Route2 0.305: v87.31,8.6 87.31,13.37 89.53,15.59 89.53,41.3 90.17,41.94 v90.17,66.07 | v111.44,68.29 v111.44,81.95
  Bottom 0.305: v111.44,68.29 108.58,68.29 107.95,67.97 103.19,67.97 100.65,66.07 v90.17,66.07
CLK1  (via drill 0.38)
  Top 0.305: v81.6,53.37 U11.11 84.77,53.37 85.41,52.73 85.41,51.47 84.77,50.83 U11.9 | U10.11 70.48,78.77 v71.44,80.04 U9.3 | v22.23,77.5 U15.5
  Route2 0.305: v81.6,87.66 v81.6,53.37 | v71.44,87.66 v71.44,80.04 | v22.23,77.5 22.23,86.39 v23.18,87.66
  Bottom 0.305: v81.6,87.66 v71.44,87.66 32.7,87.66 31.43,86.39 29.53,86.39 28.26,87.66 v23.18,87.66
CPUEN  (via drill 0.38)
  Top 0.305: U4.17 56.83,40.67 57.15,40.99 v57.15,42.58 | v64.45,54.64 U17.12 | R17.2 65.5,45.53 64.45,44.48 v64.45,42.58
  Route2 0.305: v64.45,42.58 v64.45,54.64
  Bottom 0.305: v57.15,42.58 v64.45,42.58
D0  (via drill 0.38, 0.38 pad 0.61)
  Top 0.254: v68.26,20.98 U4.38
  Top 0.305: v93.66,9.24 U6.18 | v92.08,57.18 U3.3 | v39.05,20.98 39.05,22.46 U5.9 | v91.44,36.54 U7.3
  Route2 0.305: v93.66,9.24 93.66,13.37 91.44,15.59 v91.44,20.98 v91.44,36.54 91.44,41.3 92.08,41.94 v92.08,57.18 | v14.92,20.98 14.92,61.62 14.29,62.26 11.43,62.26 X2.A9
  Bottom 0.254: v14.92,20.98 v39.05,20.98 v68.26,20.98
  Bottom 0.305: v68.26,20.98 v91.44,20.98
D1  (via drill 0.38, 0.38 pad 0.61)
  Top 0.254: v66.99,20.03 U4.37
  Top 0.305: v94.61,10.51 U6.17 | v93.03,54.64 U3.5 | v37.78,20.03 37.78,21.94 U5.8 | v92.39,35.27 U7.4
  Route2 0.305: v93.03,54.64 93.03,41.94 92.39,41.3 v92.39,35.27 v92.39,20.03 92.39,15.59 94.61,13.37 v94.61,10.51 | v15.88,20.03 15.88,62.9 14.92,63.85 13.65,64.8 11.43,64.8 X2.A8
  Bottom 0.254: v15.88,20.03 v37.78,20.03 v66.99,20.03
  Bottom 0.305: v66.99,20.03 v92.39,20.03
D2  (via drill 0.38, 0.38 pad 0.61)
  Top 0.305: v95.57,11.78 U6.16 | v65.72,19.08 U4.36 | v105.09,53.37 U3.11 | v36.51,19.08 36.51,21.41 U5.7 | v93.34,31.46 U7.7
  Route2 0.305: v95.57,11.78 95.57,13.68 93.34,15.9 v93.34,19.08 v93.34,31.46 93.34,41.3 93.98,41.94 v93.98,53.37 | v16.83,19.08 16.83,62.9 15.88,63.85 15.88,65.75 14.29,67.34 11.43,67.34 X2.A7
  Bottom 0.305: v93.34,19.08 v65.72,19.08 v36.51,19.08 v16.83,19.08 | v105.09,53.37 102.55,53.37 101.28,54.64 96.84,54.64 95.57,53.37 v93.98,53.37
D3  (via drill 0.38, 0.38 pad 0.61)
  Top 0.305: v96.52,12.73 98.11,12.73 98.42,13.05 U6.15 | v64.45,18.13 U4.35 | v110.17,55.91 U3.13 | v35.24,18.13 35.24,20.89 U5.6 | v94.3,30.19 U7.8
  Route2 0.305: v96.52,12.73 96.52,13.68 94.3,15.9 v94.3,18.13 v94.3,30.19 94.3,41.3 94.93,41.94 v94.93,58.77 | v17.78,18.13 17.78,45.43 17.46,45.75 17.46,63.21 16.83,63.85 16.83,67.34 14.29,69.88 11.43,69.88 X2.A6
  Bottom 0.305: v94.3,18.13 v64.45,18.13 v35.24,18.13 v17.78,18.13 | v94.93,58.77 96.52,57.18 108.9,57.18 v110.17,55.91
D4  (via drill 0.38)
  Top 0.305: v97.47,13.68 98.11,14.32 U6.14 100.33,14.32 | v61.91,17.18 U4.33 | v33.97,17.18 33.97,20.36 U5.5 | v104.14,30.19 U7.13
  Route2 0.305: v95.25,17.18 95.25,15.9 v97.47,13.68 | v18.73,17.18 18.73,45.43 18.1,46.07 18.1,69.25 14.92,72.42 11.43,72.42 X2.A5 | v104.14,24.16 v104.14,30.19
  Bottom 0.305: v18.73,17.18 20.32,17.18 20.64,17.49 31.11,17.49 31.43,17.18 v33.97,17.18 v61.91,17.18 v95.25,17.18 95.25,23.21 96.2,24.16 v104.14,24.16
D5  (via drill 0.38)
  Top 0.305: v96.2,16.54 97.16,15.59 U6.13 | v60.64,16.22 U4.32 | v27.3,16.54 27.3,17.18 26.35,18.13 26.35,22.9 U5.4 | v105.09,31.46 U7.14
  Route2 0.305: v19.68,16.22 19.68,45.43 18.73,46.38 18.73,71.15 14.92,74.96 11.43,74.96 X2.A4 | v105.09,22.89 v105.09,31.46
  Bottom 0.305: v19.68,16.22 20.64,16.22 21.27,16.86 26.35,16.86 26.67,16.54 v27.3,16.54 30.8,16.54 31.11,16.22 v60.64,16.22 95.89,16.22 v96.2,16.54 96.2,22.26 96.84,22.89 v105.09,22.89
D6  (via drill 0.38)
  Top 0.305: v97.16,16.86 U6.12 | v59.37,15.27 U4.31 | v25.72,15.9 25.72,17.81 25.4,18.13 25.4,23.74 U5.3 | v106.05,35.27 U7.17
  Route2 0.305: v22.54,15.9 22.54,16.54 23.81,18.45 23.81,42.26 19.37,46.7 19.37,73.06 14.92,77.5 11.43,77.5 X2.A3 | v106.05,21.62 v106.05,35.27
  Bottom 0.305: v22.54,15.9 v25.72,15.9 26.35,15.9 26.99,15.27 v59.37,15.27 96.52,15.27 97.16,15.9 v97.16,16.86 97.16,20.67 98.11,21.62 v106.05,21.62
D7  (via drill 0.38)
  Top 0.305: v98.11,18.13 U6.11 | v58.1,14.32 U4.30 | v23.81,14.95 23.81,23.95 U5.2 | v107,36.54 U7.18
  Route2 0.305: v23.81,14.95 23.81,16.86 24.45,17.81 24.45,42.58 20,47.02 20,74.96 14.92,80.04 11.43,80.04 X2.A2 | v107,20.35 v107,36.54
  Bottom 0.305: v23.81,14.95 25.08,14.95 25.72,14.32 v58.1,14.32 96.2,14.32 96.84,14.63 97.47,14.63 98.11,15.27 v98.11,18.13 98.11,19.08 99.38,20.35 v107,20.35
DATARDY  (via drill 0.38)
  Top 0.305: v89.22,74.96 U9.8 | v89.22,67.34 71.44,67.34 70.17,66.07 46.04,66.07 44.77,67.34 v39.69,67.34 | v39.69,77.5 U12.5
  Route2 0.305: v89.22,67.34 v89.22,74.96 | v39.69,67.34 v39.69,77.5
DCC0  (via drill 0.38)
  Top 0.305: v45.4,32.1 U4.22 | v68.26,76.23 U10.9 | v58.42,52.1 U17.5
  Route2 0.305: v45.4,32.1 45.4,47.66 46.67,48.93 v46.67,67.34 | v68.26,67.34 v68.26,76.23 | v58.42,52.1 58.42,58.45 60.33,60.67 v60.33,67.34
  Bottom 0.305: v46.67,67.34 v60.33,67.34 v68.26,67.34
DCC1  (via drill 0.38)
  Top 0.305: v69.22,77.82 68.9,77.5 U10.10 | v30.16,87.66 66.67,87.66 v69.22,85.12 | v25.72,44.16 25.72,37.59 U5.20
  Route2 0.305: v69.22,85.12 v69.22,77.82 | v30.16,87.66 30.16,48.61 v25.72,44.16
DCC_OUT  (via drill 0.38)
  Top 0.305: v100.01,81.95 U16.2
  Bottom 0.305: v100.01,81.95 109.22,81.95 110.49,80.67 CON2.3
DCCOUT  (via drill 0.38)
  Top 0.305: U8.7 75.88,27.65 75.25,28.29 75.25,28.92 v73.66,30.51 | v50.48,53.37 U13.11 | v73.98,81.31 U9.2 | v73.98,74.96 U10.8 | v58.1,81.31 U10.2 | v35.88,78.77 U15.11 | v22.23,56.55 U14.2
  Route2 0.305: v73.66,30.51 73.66,31.14 73.98,31.46 v73.98,60.99 v73.98,74.96 v73.98,81.31 | v50.48,60.99 v50.48,53.37 | v58.1,60.99 v58.1,81.31 | v35.88,60.99 v35.88,78.77 | v22.23,56.55 v22.23,60.99
  Bottom 0.305: v73.98,60.99 v58.1,60.99 v50.48,60.99 v35.88,60.99 v22.23,60.99
DCCOUTD  (via drill 0.38)
  Top 0.305: v70.17,77.18 71.44,77.18 71.75,77.5 U9.5 | v52.39,24.48 U4.28 | U16.1 94.93,83.22 94.3,82.58 94.3,74.01 93.66,73.37 v70.17,73.37
  Route2 0.305: v69.22,44.48 69.22,58.13 70.17,59.09 v70.17,73.37 v70.17,77.18 | v52.39,24.48 v52.39,44.48
  Bottom 0.305: v52.39,44.48 v69.22,44.48
DCCQH  (via drill 0.38)
  Top 0.305: U4.24 60.64,29.56 v62.55,31.46 | v86.36,31.46 U8.13 | v86.36,49.56 U11.8 | U15.3 v20.32,80.04 20.32,85.12 21.59,86.39 R1.1 | v74.93,54.64 U11.3
  Route2 0.305: v86.36,31.46 v86.36,49.56 v86.36,63.53 | v22.23,67.34 21.27,68.29 21.27,77.18 20.32,78.14 v20.32,80.04 | v74.93,63.53 v74.93,54.64
  Bottom 0.305: v62.55,31.46 v86.36,31.46 | v22.23,67.34 26.04,63.53 v74.93,63.53 v86.36,63.53
F1  (via drill 0.38)
  Top 0.305: U6.2 v119.7,7.97 121.92,7.97 122.34,8.38 R7.2
  Route2 0.305: v119.7,7.97 119.7,28.29 118.11,29.88 CON3.1
F2  (via drill 0.38)
  Top 0.305: U6.3 v113.67,9.24 R8.2
  Route2 0.305: CON3.2 115.57,26.38 114.62,25.43 114.62,10.51 v113.67,9.24
F3  (via drill 0.38)
  Top 0.305: v122.24,37.5 CON3.3 | U6.4 v120.65,10.51 121.92,10.51 122.34,10.92 R9.2
  Bottom 0.305: v122.24,37.5 122.24,35.27 121.92,34.95 121.92,33.05 121.6,32.73 121.6,30.19 120.65,29.24 120.65,27.65 121.6,26.7 121.6,18.13 120.65,16.86 v120.65,10.51
F4  (via drill 0.38)
  Top 0.305: U6.5 v113.67,11.78 R10.2
  Route2 0.305: v113.67,11.78 113.67,25.75 113.98,26.07 v113.98,37.5
  Bottom 0.305: v113.98,37.5 CON3.4
F5  (via drill 0.38)
  Top 0.305: U6.6 v121.6,13.05 121.92,13.05 122.34,13.46 R11.2 | v122.24,40.04 CON3.5
  Bottom 0.305: v122.24,40.04 123.19,39.08 123.19,18.76 121.6,16.86 v121.6,13.05
F6  (via drill 0.38)
  Top 0.305: U6.7 v112.71,14.32 R12.2
  Route2 0.305: v112.71,14.32 112.71,26.07 113.03,26.38 v113.03,40.67
  Bottom 0.305: v113.03,40.67 113.67,40.04 CON3.6
F7  (via drill 0.38)
  Top 0.305: U6.8 v122.56,15.59 122.56,16.64 R13.2
  Route2 0.305: v122.56,15.59 122.56,26.7 122.87,27.02 122.87,36.54 123.19,36.86 123.19,41.62 v122.24,42.58
  Bottom 0.305: v122.24,42.58 CON3.7
F8  (via drill 0.38)
  Top 0.305: U6.9 v111.44,16.86 R14.2
  Route2 0.305: v111.44,16.86 111.44,25.75 112.39,26.7 112.39,39.72 111.76,40.35 v111.76,42.58
  Bottom 0.305: v111.76,42.58 CON3.8
GND  (via drill 0.38, 1)  (1 unrouted)
  Top 0.254: 103.82,41.3 C18.2 | R4.1 103.82,43.21
  Top 0.305: 104.14,79.41 U16.4 | 104.14,78.14 U16.12 | 79.38,28.92 U8.6 | U14.3 23.5,55.27 v22.23,54.01 | v22.23,54.01 U14.4 | U14.5 23.5,52.73 v22.23,54.01 | U1.5 18.73,9.24 15.88,6.38 15.88,5.11
  Top 0.61: U18.7 v79.06,6.06 | U1.8 18.41,5.43 18.1,5.11 15.88,5.11 X2.B32
  Top 0.813: v101.6,48.93 v102.87,48.93 103.72,48.93 | v74.93,22.89 v74.93,24.16 74.93,25.75 75.56,26.38 U8.8 78.74,26.38 79.38,27.02 79.38,28.92 79.38,35.59 | 79.38,35.59 79.33,35.64 | 79.33,15.32 79.69,14.95 v79.69,6.7 v79.06,6.06 | 45.72,4.16 v46.67,4.16 | 45.72,4.16 v45.4,4.16 | 45.72,4.16 42.31,4.25 42.31,5.41 U20.8 44.13,5.43 44.4,5.7 C4.2 35.88,16.22 35.56,15.9 32.38,15.9 32.07,16.22 C1.2 | U6.10 107.31,18.13 v105.73,16.54 105.73,6.7 105.78,6.65 C7.2 | U16.8 v103.5,74.33 v104.14,74.96 104.14,78.14 104.14,79.41 104.14,83.22 103.78,83.58 C9.2 | R4.1 v101.92,43.53 v100.97,43.53 | U11.7 v79.06,49.56 v79.69,50.2 79.69,57.18 79.33,57.55 C16.2 | U17.7 v61.91,49.56 v62.23,50.51 62.23,50.67 62.18,51.51 C15.2 | U14.8 v27.62,48.93 v28.26,49.56 28.26,57.81 27.89,58.18 C13.2 27.89,61.26 30.42,63.78 X1.2 | U13.7 v44.13,49.56 v44.45,50.51 44.4,50.88 C14.2 | U15.7 v27.62,74.96 v28.26,75.59 28.26,82.58 27.89,82.95 C12.2 | U9.7 v79.38,74.96 v79.38,75.91 79.38,82.9 79.33,82.95 C6.2 | U12.7 v44.13,74.96 v44.77,75.59 44.77,82.58 44.4,82.95 C10.2 | U10.7 v61.91,74.96 v62.55,75.59 62.55,82.58 62.18,82.95 C5.2 | U4.8 68.26,40.99 v68.9,41.62 v70.17,41.62 | C17.2 46.04,20.03 45.4,20.67 v45.4,23.21 v45.4,24.48 | v36.51,38.45 v36.51,37.18 36.4,36.54 U5.14 | C20.2 18.41,29.24 20,30.83 v20.64,30.83 v21.27,31.46 | 103.5,50.83 U3.8 | 103.5,50.83 103.73,50.83 103.78,50.88 C8.2 103.72,62.31 | R3.1 103.72,48.93 | 103.72,48.93 103.72,50.61 103.5,50.83 | R6.1 v103.72,66.07 | v103.72,66.07 R5.1 | v103.72,66.07 v102.55,66.07 | 103.82,41.3 103.82,40.04 102.87,39.08 v102.87,27.65 v101.6,27.65 U7.10 | 79.38,35.59 79.33,35.59 C2.2
  other vias: 105.73,15.27 115.57,50.2 118.11,50.2 115.57,47.66 118.11,47.66
  pour Route15 (isolate 0.305): 0.58,0.45 0.58,89.56 124.46,89.56 124.46,0.45
HL_FEEDBACK  (via drill 0.38)
  Top 0.305: U3.10 v112.39,52.1
  Route2 0.305: v112.39,52.1 v112.39,79.41
  Bottom 0.305: v112.39,79.41 116.84,79.41 CON2.4
LCPUEN  (via drill 0.38)
  Top 0.305: U17.9 v68.26,50.83 | v50.48,77.5 U12.10
  Route2 0.305: v68.26,50.83 68.26,59.09 69.22,60.36 v69.22,74.01 | v50.48,73.69 v50.48,77.5
  Bottom 0.305: v69.22,74.01 68.58,73.69 v50.48,73.69
MOTOR_FEEDBACK  (via drill 0.38)
  Top 0.305: v98.11,58.45 U3.2
  Route2 0.305: v98.11,58.45 v98.11,62.9
  Bottom 0.305: CON2.17 110.17,62.9 109.54,63.53 106.05,63.53 105.73,62.9 v98.11,62.9
N$2
  Top 0.305: U1.14 JMPR2.P$1
N$3
  Top 0.305: U1.13 JMPR3.P$1
N$4
  Top 0.305: U1.12 JMPR4.P$1
N$5  (via drill 0.38)
  Top 0.305: v73.03,55.91 U11.2 | v55.56,80.04 U10.3
  Route2 0.305: v73.03,72.42 v73.03,55.91 | v55.56,72.42 v55.56,80.04
  Bottom 0.305: v55.56,72.42 v73.03,72.42
N$6
  Top 0.305: U1.11 JMPR5.P$1
N$7
  Top 0.305: U1.10 JMPR6.P$1
N$8
  Top 0.305: U1.9 JMPR7.P$1
N$9  (via drill 0.38)
  Top 0.305: U13.12 v52.39,54.64 | v52.39,74.96 55.56,74.96 56.83,76.23 U10.6
  Route2 0.305: v52.39,54.64 v52.39,74.96
N$10  (via drill 0.38)
  Top 0.305: U13.9 v53.34,50.83 | v53.34,78.77 U10.4
  Route2 0.305: v53.34,50.83 v53.34,78.77
N$11
  Top 0.305: U1.7 27.94,6.7 30.48,4.16 JMPR8.P$1
N$12
  Top 0.305: JMPR2.P$2 38.42,11.78 38.73,11.46 38.73,10.51 | 38.73,6.7 38.73,7.97 | 38.73,7.97 38.73,8.6 | 38.73,8.6 38.73,9.24 | 38.73,9.24 38.73,10.51 | 38.73,5.11 38.73,6.7 | 38.73,5.11 38.73,5.43 JMPR7.P$2 | 38.73,6.7 JMPR6.P$2 | 38.73,7.97 JMPR5.P$2 | 38.73,10.51 JMPR3.P$2 | 38.73,9.24 JMPR4.P$2 | JMPR8.P$2 38.1,4.16 38.42,4.48 38.42,4.79 38.73,5.11 | U20.5 40.64,9.24 40.01,8.6 38.73,8.6
N$16  (via drill 0.38)
  Top 0.305: v97.16,37.81 U7.2
  Route2 0.305: v101.28,64.8 101.28,59.4 98.11,56.23 98.11,47.66 98.42,47.34 98.42,41.94 97.79,41.3 97.16,40.67 v97.16,37.81
  Bottom 0.305: CON2.14 117.16,66.7 114.3,66.7 113.67,66.07 106.05,66.07 104.78,64.8 v101.28,64.8
N$17  (via drill 0.38)
  Top 0.305: v95.89,34 U7.5 | v121.28,65.44 CON2.16
  Route2 0.305: v120.97,33.69 120.97,34.32 120.65,34.64 120.65,43.53 121.28,44.16 v121.28,65.44
  Bottom 0.305: v95.89,34 113.98,34 114.3,33.69 v120.97,33.69
N$18  (via drill 0.38)
  Top 0.305: v97.16,32.73 U7.6 | v119.38,62.9 CON2.18
  Route2 0.305: v119.38,31.78 v119.38,62.9
  Bottom 0.305: v97.16,32.73 114.94,32.73 115.89,31.78 v119.38,31.78
N$19  (via drill 0.38)
  Top 0.305: v97.16,28.92 U7.9 | v120.33,60.36 CON2.20
  Route2 0.305: v120.02,30.19 120.33,30.83 120.33,32.41 120.02,32.73 120.02,43.84 120.33,44.16 v120.33,60.36
  Bottom 0.305: v97.16,28.92 112.71,28.92 113.03,28.61 119.06,28.61 v120.02,30.19
N$20  (via drill 0.38)
  Top 0.305: U7.12 112.71,28.92 113.03,28.61 v121.6,28.61 | v122.24,57.81 CON2.22
  Route2 0.305: v121.6,28.61 121.6,32.73 121.92,33.05 121.92,34.32 121.28,34.95 121.28,43.21 122.24,44.16 122.24,55.59 121.92,55.91 121.92,56.86 122.24,57.18 v122.24,57.81
N$21  (via drill 0.38)
  Top 0.305: U7.15 v116.84,32.73 | v116.84,54.01 CON2.24
  Route2 0.305: v116.84,32.73 v116.84,54.01
N$42
  Top 0.305: U10.12 65.09,80.04 64.45,79.41 64.45,74.33 63.82,73.69 52.07,73.69 50.8,74.96 U12.8
N$43  (via drill 0.38)
  Top 0.305: v70.17,81.31 U10.13 | v46.67,78.77 U12.11
  Route2 0.305: v70.17,81.31 70.17,79.72 71.12,78.45 v71.12,69.88 | v46.67,69.88 v46.67,78.77
  Bottom 0.305: v46.67,69.88 v71.12,69.88
N$48  (via drill 0.38)
  Top 0.305: v85.41,54.64 U11.12 | v21.27,78.77 U15.4
  Route2 0.305: v85.41,88.3 v85.41,54.64 | v21.27,78.77 v21.27,87.66
  Bottom 0.305: v21.27,87.66 22.54,88.93 84.77,88.93 v85.41,88.3
N$50
  Top 0.305: R27.1 41.27,61.62 40.64,60.99 40.64,57.18 | 40.64,54.64 40.64,53.37 U13.4 | 40.64,54.64 40.64,55.91 | 40.64,55.91 40.64,57.18 | U13.3 40.64,54.64 | 40.64,55.91 U13.2 | 40.64,57.18 U13.1
OSC1  (via drill 0.38)
  Top 0.305: v71.12,53.37 U17.11 | U15.8 v36.83,74.96
  Route2 0.305: v71.12,68.61 v71.12,53.37 | v36.83,74.96 v36.83,68.61
  Bottom 0.305: v36.83,68.61 v71.12,68.61
PA0
  Top 0.305: U4.5 73.98,35.91 75.88,34 U8.2
PA1
  Top 0.305: U4.4 73.98,34.64 75.88,32.73 U8.3
PA2
  Top 0.305: U4.3 73.98,33.37 75.88,31.46 U8.4
PA3
  Top 0.305: U4.2 73.34,32.1 75.25,30.19 U8.5
PA4  (via drill 0.38)
  Top 0.305: U4.44 v73.03,29.56 | v85.41,27.65 U8.10
  Bottom 0.305: v73.03,29.56 76.52,29.56 77.15,28.92 82.87,28.92 84.14,27.65 v85.41,27.65
PA5  (via drill 0.38)
  Top 0.305: U4.43 v73.66,28.29 | v80.64,27.65 81.6,28.92 U8.11
  Bottom 0.305: v73.66,28.29 76.52,28.29 77.15,27.65 v80.64,27.65
PA6  (via drill 0.38)
  Top 0.305: U4.42 v73.03,27.02 | v86.36,30.19 U8.12
  Route2 0.305: v86.36,26.38 v86.36,30.19
  Bottom 0.305: v73.03,27.02 76.52,27.02 77.15,26.38 v86.36,26.38
PA7  (via drill 0.38)
  Top 0.305: U4.41 v73.66,25.75 | v87.31,32.73 U8.14
  Route2 0.305: v87.31,25.11 v87.31,32.73
  Bottom 0.305: v73.66,25.75 76.52,25.75 77.15,25.11 v87.31,25.11
PCRST  (via drill 0.38)
  Top 0.305: v23.18,82.58 U15.1 | v58.1,46.38 U4.16 | v23.18,46.38 R16.2
  Route2 0.305: v23.18,46.38 v23.18,82.58
  Bottom 0.305: v23.18,46.38 v58.1,46.38
PU403
  Top 0.305: U17.2 58.74,55.91 58.1,56.55 58.1,58.45 59.37,59.72 59.37,60.99 60.01,61.62 R15.2 62.13,63.11 62.55,63.53 67.63,63.53 68.26,62.9 68.26,56.55 67.63,55.91 U17.13
PU502  (via drill 0.38)
  Top 0.305: v74.93,82.58 U9.1 | v21.27,51.47 U14.6 | v39.05,84.48 R2.1
  Route2 0.305: v21.27,51.47 21.27,52.73 20.64,53.37 20.64,76.86 19.37,78.14 v19.37,84.48
  Bottom 0.305: v74.93,82.58 59.37,82.58 58.1,83.85 51.12,83.85 50.48,83.22 42.86,83.22 41.59,84.48 v39.05,84.48 37.78,83.22 30.16,83.22 28.89,84.48 v19.37,84.48
RCO  (via drill 0.38)
  Top 0.305: U14.15 v38.73,56.55 | v38.73,81.31 U12.2 | v38.73,78.77 U12.4
  Route2 0.305: v38.73,56.55 v38.73,78.77 v38.73,81.31
RDBAK  (via drill 0.38)
  Top 0.305: v89.22,54.01 90.81,54.01 92.71,55.91 U3.4 | U18.13 v86.36,12.41
  Route2 0.305: v86.36,12.41 86.36,13.37 88.58,15.59 88.58,41.3 89.22,41.94 v89.22,54.01
RL_FEEDBACK  (via drill 0.38)
  Top 0.305: U3.14 113.98,57.18 114.94,56.55 v122.87,56.55
  Route2 0.305: v122.87,56.55 122.87,57.18 123.19,57.5 123.19,71.15 122.87,71.47 v122.87,73.06
  Bottom 0.305: v122.87,73.06 CON2.10
RST  (via drill 0.38)
  Top 0.305: v79.38,22.89 78.42,21.94 73.03,21.94 72.39,22.57 69.69,22.57 U4.39
  Route2 0.305: v80.64,77.5 80.64,76.23 80.96,75.91 80.96,54.32 80.64,54.01 80.64,51.47 80.96,51.15 80.96,31.46 79.38,29.88 v79.38,22.89
  Bottom 0.305: X2.B2 22.23,81.31 23.5,80.04 39.05,80.04 40.32,81.31 56.2,81.31 58.1,79.41 61.59,79.41 66.04,74.96 68.58,74.96 69.85,76.23 71.12,76.23 72.39,77.5 v80.64,77.5
SCOPE  (via drill 0.38)
  Top 0.305: v96.2,75.59 U16.7 | v73.03,53.37 U11.4 | U4.27 v53.34,25.75
  Route2 0.305: v96.2,45.43 v96.2,75.59 | v73.03,45.43 v73.03,53.37 | v53.34,25.75 v53.34,45.43
  Bottom 0.305: v96.2,45.43 v73.03,45.43 v53.34,45.43
SCOPE_SYNC  (via drill 0.38)
  Top 0.305: v99.38,76.86 U16.6
  Bottom 0.305: v99.38,76.86 100.11,76.86 103.61,72.42 109.86,72.42 110.49,73.06 CON2.9
SHIFTIN  (via drill 0.38)
  Top 0.305: U8.1 76.2,35.27 v74.93,36.54 | v105.09,37.81 U7.19
  Bottom 0.305: v74.93,36.54 76.83,38.13 85.41,38.13 87.31,40.35 102.55,40.35 v105.09,37.81
UNDERFLOW  (via drill 0.38)
  Top 0.305: U4.20 52.7,34.64 v50.48,37.18 | v50.48,49.56 U13.8
  Route2 0.305: v50.48,37.18 v50.48,49.56
VCC  (via drill 0.38)  (4 unrouted)
  Top 0.305: v40.64,7.97 U20.6 | U5.19 27.93,37.48 v28.89,38.45 | v26.99,28.92 26.99,28.29 28.26,27.02 29.53,27.02 32.7,30.19 32.7,31.05 U5.13 | R15.1 65.72,61.62 66.36,60.99 v66.36,59.72 | v32.7,84.48 R2.2 | v32.07,85.12 32.07,85.75 31.43,86.39 R1.2 | 28.84,16.18 C1.1 | U13.14 46.35,57.18 45.72,56.55 45.72,49.56 44.35,48.19 R18.1 | R16.1 29.95,59.67 C13.1 | R17.1 63.4,56.45 64.18,57.23 C15.1
  Top 0.406: R27.2 47.94,61.62 48.58,60.99 v48.58,59.72
  Top 0.61: U18.14 83.5,13.68 | v29.21,12.73 29.21,13.37 29.21,13.68 | 29.21,14.32 U1.16 | C2.1 82.55,37.5 v82.87,37.18 | v83.5,22.89 v84.14,22.26 v82.87,22.26 v83.5,22.89
  Top 0.813: C8.1 v107.31,62.26 107.95,62.26 | 107.95,62.26 v108.58,62.26 112.08,62.26 114.94,65.44 CON2.15 | 107.95,62.26 107.85,62.16 107.95,62.06 v107.95,61.62 107.95,60.99 107.85,60.89 U3.16 106.05,59.72 105.41,59.09 105.41,55.27 106.05,54.64 U3.12 | 107.95,41.62 v107.31,41.62 C18.1 | 107.95,41.62 v108.58,41.62 | v82.87,37.18 83.5,37.18 | v84.14,37.18 83.5,37.18 | 83.5,37.18 83.4,37.08 | v82.87,22.26 83.5,22.26 | v84.14,22.26 83.5,22.26 | 83.5,22.26 83.4,22.15 83.4,15.59 | C7.1 v100.33,4.79 99.69,4.79 | 99.69,4.79 v99.06,4.79 | 99.69,4.79 99.75,4.84 U6.20 99.75,4.21 v99.69,4.16 | C9.1 v107.31,85.12 107.95,85.12 | v108.58,85.12 107.95,85.12 | U16.16 107.85,85.02 107.95,85.12 | 107.95,41.62 v107.95,40.67 107.95,39.4 108.27,39.08 U7.20 | C16.1 v82.87,59.09 83.5,59.09 | 83.5,59.09 v84.14,59.09 | v83.5,59.72 83.5,59.09 | 83.5,59.09 83.5,57.18 | C15.1 v65.72,59.09 66.36,59.09 | 66.36,59.09 66.36,57.28 U17.14 | 66.36,59.09 v66.99,59.09 | v66.36,59.72 66.36,59.09 | C13.1 v31.43,59.72 32.07,59.72 | 32.07,59.72 v32.7,59.72 | v32.07,59.09 32.07,59.72 | U14.16 31.97,59.62 32.07,59.72 | C14.1 v47.94,59.09 48.58,59.09 | 48.58,59.09 v49.21,59.09 | 48.58,59.09 v48.58,59.72 48.58,57.18 | C12.1 v31.43,84.48 32.07,84.48 | 32.07,84.48 v32.7,84.48 | 32.07,84.48 v32.07,85.12 32.07,82.58 | C6.1 v82.87,84.48 83.5,84.48 | U9.14 83.4,84.38 83.5,84.48 | 83.5,84.48 v84.14,84.48 | v83.5,85.12 83.5,84.48 | C10.1 v47.94,84.48 48.58,84.48 | 48.58,84.48 v49.21,84.48 | U12.14 48.48,84.38 48.58,84.48 | v48.58,85.12 48.58,84.48 | C5.1 v65.72,84.48 66.36,84.48 | 66.36,84.48 v66.99,84.48 | U10.14 66.26,84.38 66.36,84.48 | v66.36,85.12 66.36,84.48 | U4.29 55.72,22.73 v55.56,22.57 54.93,22.57
  Top 0.813: C17.1 55.29,22.21 54.93,22.57 | v54.93,23.21 54.93,22.57 | 54.93,22.57 v54.29,22.57 | v26.35,29.56 v25.72,28.92 | v26.35,29.56 v26.99,28.92 26.35,28.92 | v25.72,28.92 26.35,28.92 | v26.35,29.56 26.35,28.92 | v25.72,28.92 25.19,28.92 U5.28 22.86,26.59 22.86,23.84 22.23,23.21 C20.1 | v28.89,38.45 v29.53,39.08 | X1.4 26.35,69.88 26.99,69.25 v31.43,69.25 | v31.43,69.25 32.07,69.25 | 83.4,15.59 U18.14 | v31.43,69.25 v32.07,68.61 v32.7,69.25 v31.43,69.25 | v83.5,36.54 v84.14,37.18 | v84.14,37.18 v82.87,37.18 | v83.5,36.54 v82.87,37.18 | U8.16 83.4,36.44 v83.5,36.54 | 48.58,16.22 C4.1 | 48.58,16.22 54.29,16.22 55.24,17.18 55.24,20.03 | 83.4,15.59 C19.1 | 29.21,13.37 v29.84,13.37 v29.21,12.73 v28.57,13.37 29.21,13.37 | R14.1 v118.75,16.86 R13.1 | R12.1 v118.75,14.32 R11.1 | R10.1 v118.75,11.78 R9.1 | R8.1 v118.75,9.24 R7.1 | U20.16 48.48,15.8 48.58,15.9 48.58,16.22 | 28.84,16.18 28.84,15 29.21,14.63 29.21,14.32 29.21,13.37
  Route2 0.305: 48.58,7.97 v46.67,7.97 | 48.58,15.49 48.48,15.59
  Route2 0.813: 107.95,85.12 v108.58,85.12 | 48,13.74 48.48,15.59 48.48,16.01 48.26,16.22 | v118.75,16.86 v118.75,14.32 v118.75,11.78 v118.75,9.24 117.47,7.97 117.47,3.84 115.89,2.25 107.95,2.25
  Route2 2.184: 107.95,85.12 v107.95,61.62 v107.95,40.67 107.95,39.72 108.9,38.77 108.9,18.76 107.95,17.49 107.95,2.25 99.69,2.25 | 99.69,4.79 v99.69,4.16 99.69,2.25 | v83.5,85.12 v83.5,59.72 v83.5,36.54 v83.5,22.89 83.5,2.25 | v66.36,85.12 v66.36,59.72 66.36,39.08 55.88,28.61 55.88,26.38 54.93,24.48 v54.93,23.21 54.93,2.25 | v48.58,85.12 v48.58,59.72 48.58,15.49 48.58,7.97 48.58,2.25 | v32.07,85.12 v32.07,68.61 v32.07,59.09 32.07,41.62 v29.53,39.08 v28.89,38.45 26.35,35.91 v26.35,29.56 26.35,25.75 29.21,22.89 v29.21,12.73 29.21,2.25 48.58,2.25 | 83.5,2.25 99.69,2.25 | 48.58,2.25 54.93,2.25 | 54.93,2.25 83.5,2.25
  Bottom 0.305: v46.67,7.97 v40.64,7.97
  Bottom 0.813: X2.B3 15.88,78.77 25.4,69.25 v31.43,69.25 | X2.B29 v29.21,12.73 | v31.43,69.25 v32.07,68.61 v32.7,69.25 v31.43,69.25 | v29.21,12.73 v28.57,13.37 v29.84,13.37 v29.21,12.73
(copper drawn outside any net)
  shapes: Top circle x2

## Text on the board
Top: TOP COPPER
Route2: LAYER 2 COPPER
Route15: LAYER 3 COPPER
Bottom: SENDER | SERIES 3 | PC/104 REV E | BOTTOM COPPER
tPlace: DIGITAL COMMAND CONTROL | DECODER TEST BOARD | (C) 2010, BY BRIAN BARNT | SERIES 3 REVISION E | SERIAL NO.: | 201005 | TOP SILK SCREEN
tNames: 240 | 280 | 2C0 | 300 | 340 | 380 | 3C0
tStop: TOP SOLDER MASK
bStop: BOTTOM SOLDER MASK
Measures: 3.55" | 4.900"
Document: NOTES: | PCB-0031 | E | 1 OF 1
Stencil_Frame: Send 3 A | PCB-0031 | BJ BARNT | 180 um